# EAGLE design Gameboy_Cartridge (EAGLE 9.5.2)
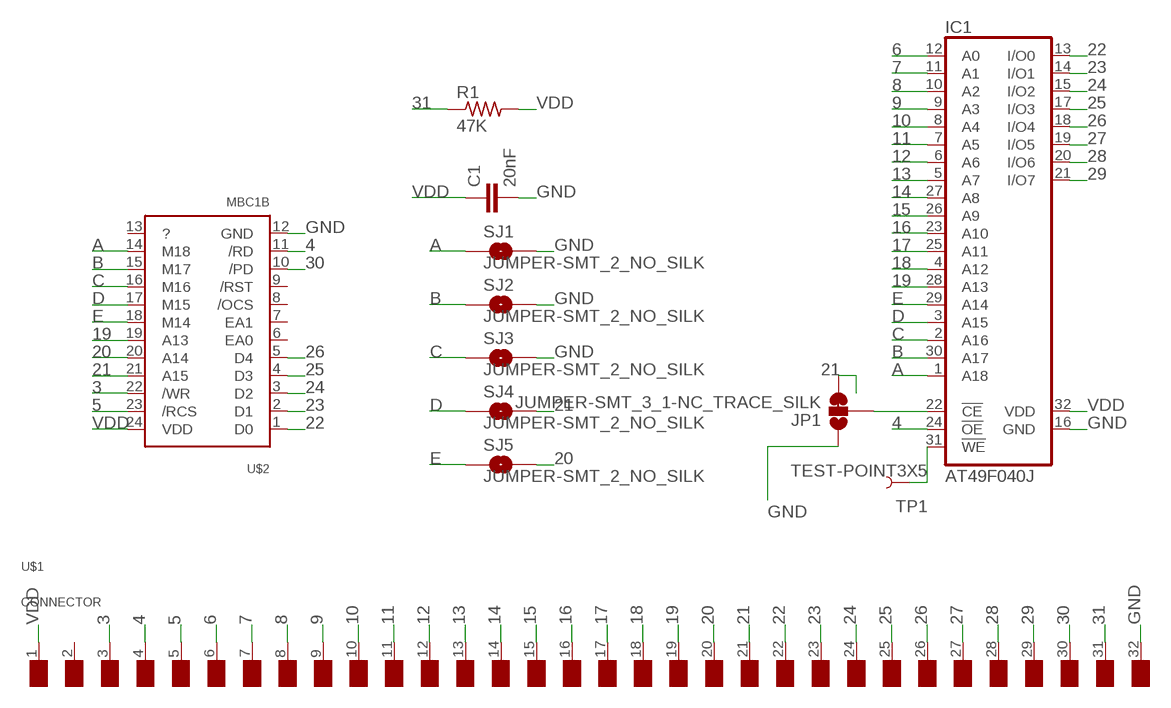
[diagram p0: schematic, sheet 1]

## Parts
C1  20nF  C-EUC0805  [C0805]
IC1  AT49F040J  [PLCC32R]
JP1  JUMPER-SMT_3_1-NC_TRACE_SILK  [SMT-JUMPER_3_1-NC_TRACE_SILK]
R1  47K  R-US_M0805  [M0805]
SJ1  JUMPER-SMT_2_NO_SILK  [SMT-JUMPER_2_NO_SILK]
SJ2  JUMPER-SMT_2_NO_SILK  [SMT-JUMPER_2_NO_SILK]
SJ3  JUMPER-SMT_2_NO_SILK  [SMT-JUMPER_2_NO_SILK]
SJ4  JUMPER-SMT_2_NO_SILK  [SMT-JUMPER_2_NO_SILK]
SJ5  JUMPER-SMT_2_NO_SILK  [SMT-JUMPER_2_NO_SILK]
TP1  TEST-POINT3X5  [PAD.03X.05]
U$1  CONNECTOR  [CONNECTOR]
U$2  MBC1B  [MBC1B]

## Nets
3: U$1.3(/WR) U$2.22(/WR)
4: IC1.24(!OE) U$1.4(/RD) U$2.11(/RD)
5: U$1.5(/RCS) U$2.23(/RCS)
6: IC1.12(A0) U$1.6(A0)
7: IC1.11(A1) U$1.7(A1)
8: IC1.10(A2) U$1.8(A2)
9: IC1.9(A3) U$1.9(A3)
10: IC1.8(A4) U$1.10(A4)
11: IC1.7(A5) U$1.11(A5)
12: IC1.6(A6) U$1.12(A6)
13: IC1.5(A7) U$1.13(A7)
14: IC1.27(A8) U$1.14(A8)
15: IC1.26(A9) U$1.15(A9)
16: IC1.23(A10) U$1.16(A10)
17: IC1.25(A11) U$1.17(A11)
18: IC1.4(A12) U$1.18(A12)
19: IC1.28(A13) U$1.19(A13) U$2.19(A13)
20: SJ5.2 U$1.20(A14) U$2.20(A14)
21: JP1.3 SJ4.2 U$1.21(A15) U$2.21(A15)
22: IC1.13(I/O0) U$1.22(D0) U$2.1(D0)
23: IC1.14(I/O1) U$1.23(D1) U$2.2(D1)
24: IC1.15(I/O2) U$1.24(D2) U$2.3(D2)
25: IC1.17(I/O3) U$1.25(D3) U$2.4(D3)
26: IC1.18(I/O4) U$1.26(D4) U$2.5(D4)
27: IC1.19(I/O5) U$1.27(D5)
28: IC1.20(I/O6) U$1.28(D6)
29: IC1.21(I/O7) U$1.29(D7)
30: U$1.30(/RS) U$2.10(/PD)
31: R1.1 U$1.31(VIN)
A: IC1.1(A18) SJ1.1 U$2.14(M18)
B: IC1.30(A17) SJ2.1 U$2.15(M17)
C: IC1.2(A16) SJ3.1 U$2.16(M16)
D: IC1.3(A15) SJ4.1 U$2.17(M15)
E: IC1.29(A14) SJ5.1 U$2.18(M14)
GND: C1.2 IC1.16(GND) JP1.1 SJ1.2 SJ2.2 SJ3.2 U$1.32(GND) U$2.12(GND)
N$1: IC1.31(!WE) TP1.P$1
N$2: IC1.22(!CE) JP1.2
VDD: C1.1 IC1.32(VDD) R1.2 U$1.1(VDD) U$2.24(VDD)
Unconnected: U$1.2(NC) U$2.6(EA0) U$2.7(EA1) U$2.8(/OCS) U$2.9(/RST) U$2.13(?)

## Library data of the parts
C1 = resistor:C-EU: CAPACITOR, European symbol
IC1 = gameboy:AT49F040J: 4-Megabit FLASH MEMORY (512 K x 8 bit) 5 V-only
JP1 = SparkFun-Jumpers:JUMPER-SMT_3_1-NC_TRACE: Normally closed trace jumper (1 of 2 connections) This jumper has a trace between two pads so it's normally closed (NC). The other connection is normally open (NO). Use a razor knife to open the connection. For best results follow the IPC guidelines for cutting traces: Cutout at least 0.063 mm (0.005 in). Remove all loose material to clean up the cut area. Seal the cut with an approved epoxy. Reapply solder to reclose the connection, or to close the NO connection.
R1 = resistor:R-US_: RESISTOR, American symbol
SJ1-SJ5 = SparkFun-Jumpers:JUMPER-SMT_2_NO: Normally open jumper This jumper has two pads in close proximity to each other. Apply solder to close the connection. Round pads are easier to solder for beginners, but are a lot larger. SparkFun Product that uses the round pads: SparkFun EL Sequencer <https://www.sparkfun.com/products/12781>
TP1 = SparkFun-Connectors:TEST-POINT: SparkFun Test Points Bare copper test points for troubleshooting or In-Circuit-Testing. These are used by our Production team for verifying production board runs using pogo-pins on test beds. SparkFun Products: SparkFun LSM9DS1 Breakout <https://www.sparkfun.com/products/13284> SparkFun PSOC <https://www.sparkfun.com/products/13714> SparkFun Load Cell Amplifier <https://www.sparkfun.com/products/13879>
U$1 = gameboy:CONNECTOR: Connector Pads for Gameboy Cartridges
U$2 = gameboy:MBC1B: Nintendo Gameboy cartridge Memory Bank Controller (MBC) Specifically based on the MBC1-B chip

## Board
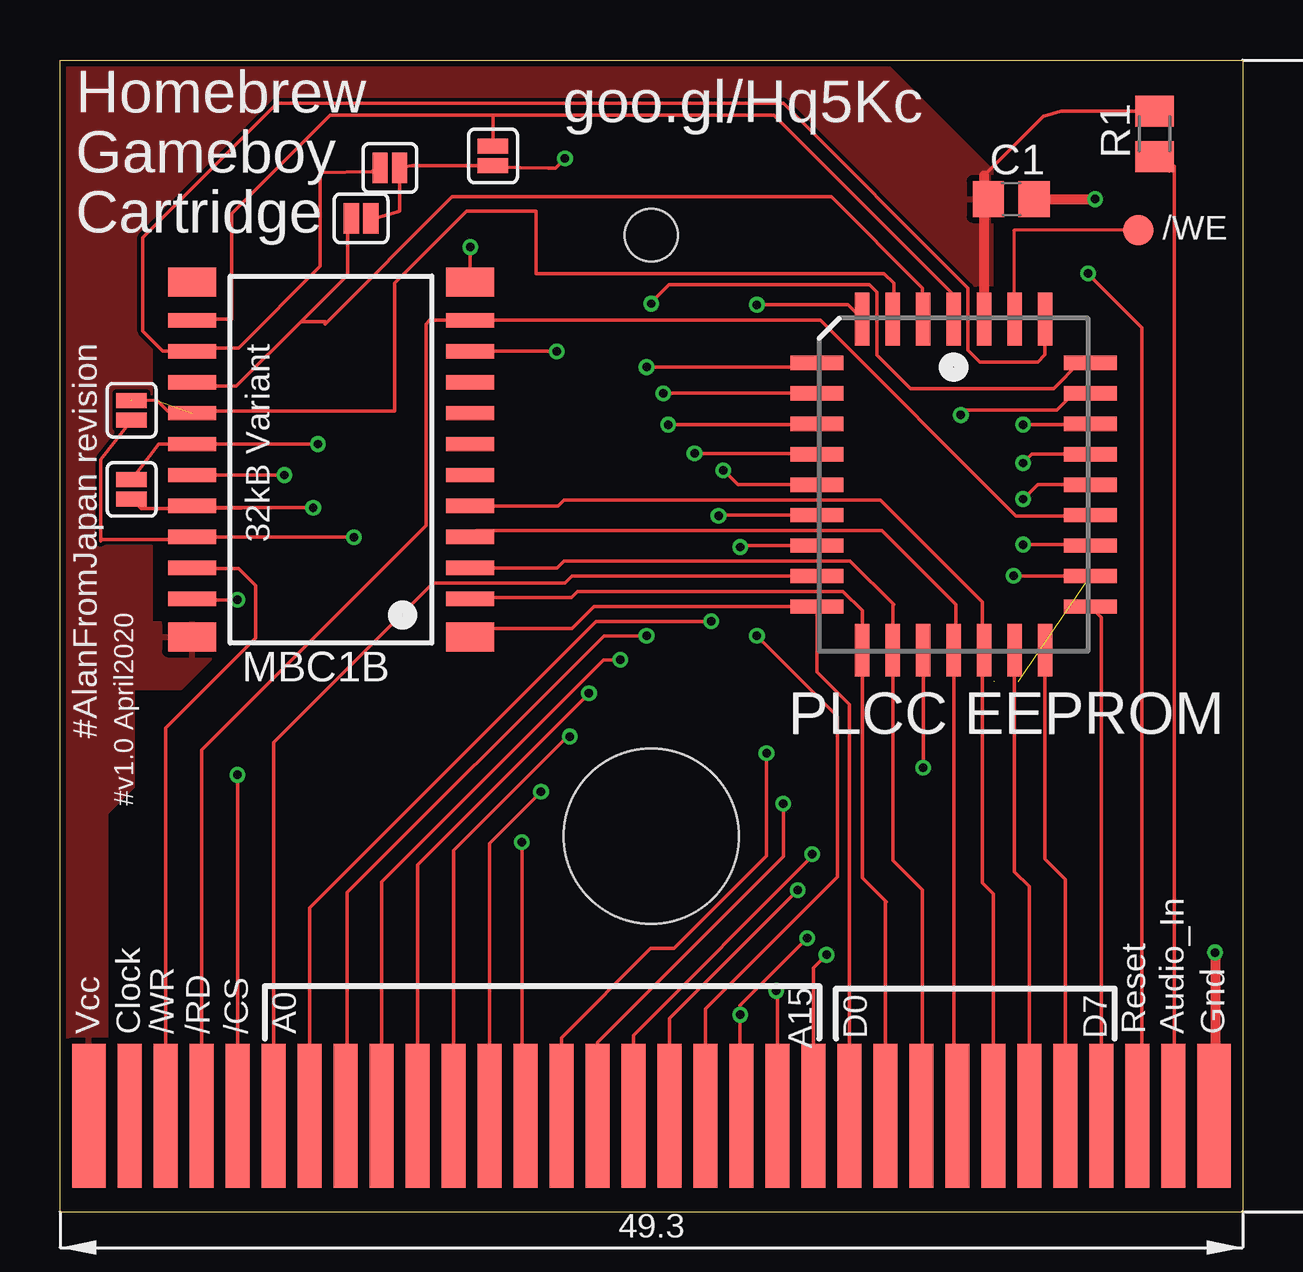
[diagram p1: board, top side]
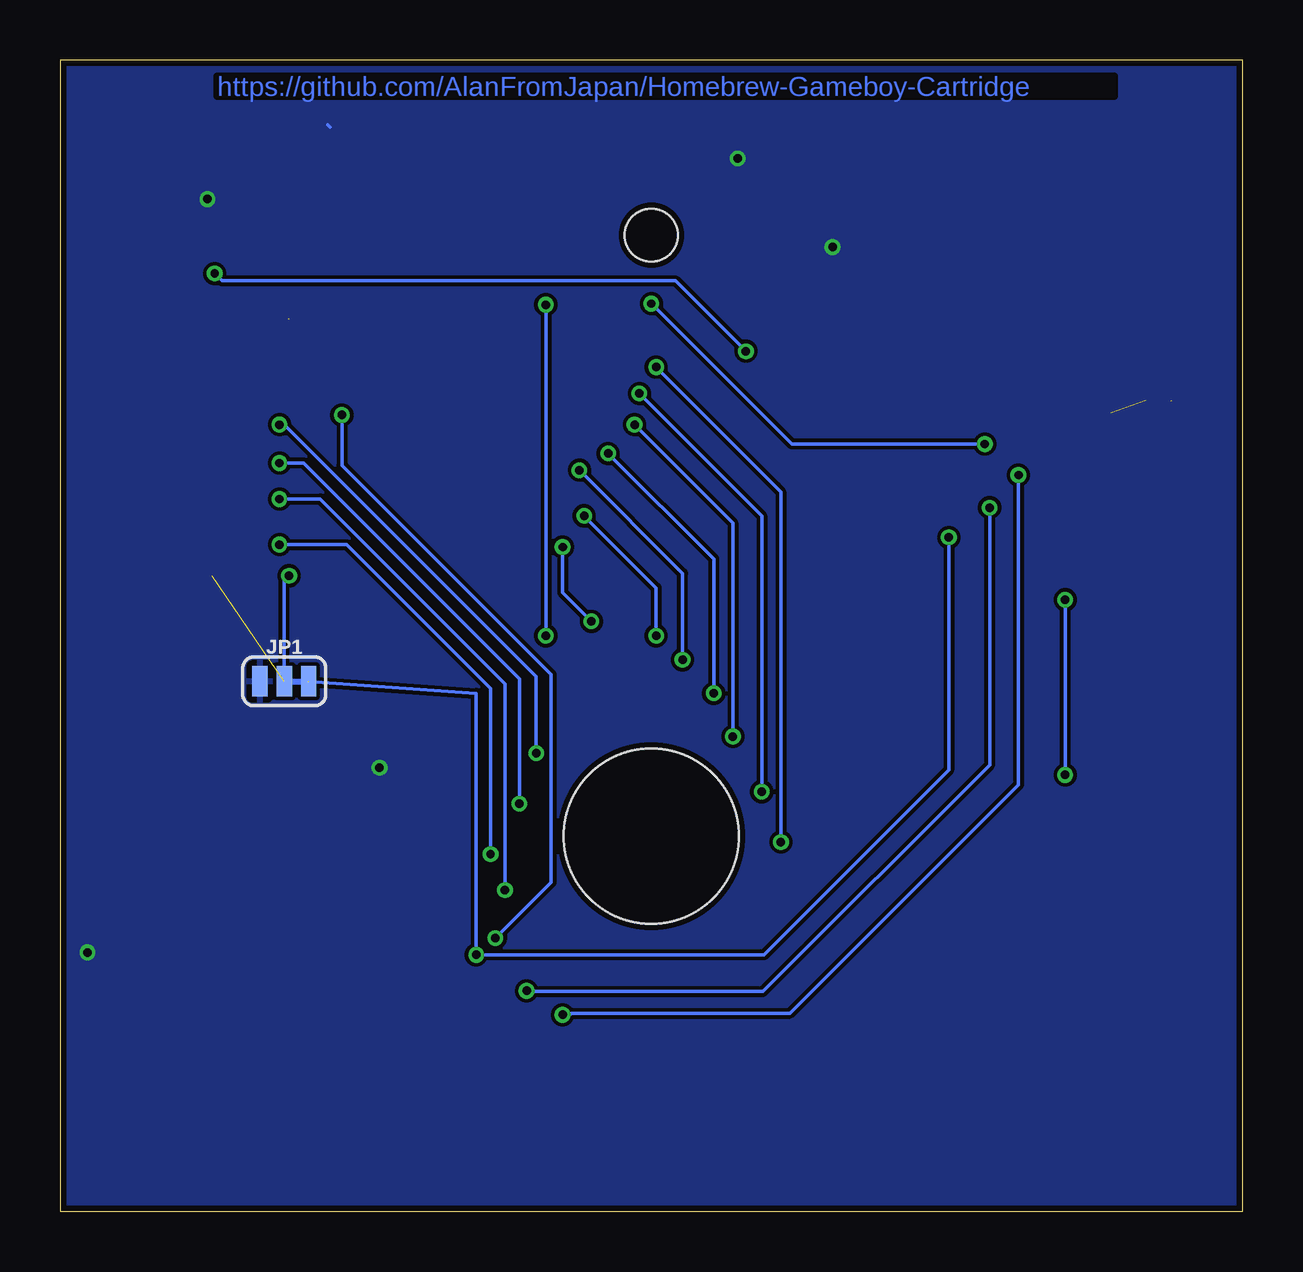
[diagram p2: board, bottom side, seen from below]

Size 49.3 x 48 mm. Coordinates in mm from the lower left corner, seen from the top.
Outline: 49.3,48 49.3,0 0,0 0,48 49.3,48
Copper layers (1*16): Top 0.035mm / dielectric 1.5mm / Bottom 0.035mm
Design rules "default": minimum track width 6mil, minimum drill 12mil, track to track 6mil, track to pad 6mil, pad to pad 6mil, via to via 6mil, smd to smd 0mil, copper to edge 10mil, drill to drill 10mil, minimum pad ring 10mil, minimum via ring 6mil, stop-mask expansion 2mil, vias tented up to drill 100mil, thermal gap 10mil
Holes 7.3 mm at 24.65,15.65
Holes 2.2 mm at 24.65,40.7

### Footprints (pad centres in the part's own frame; a part is rotated, then mirrored left to right if it is on the bottom)
C0805 = smd 1.3 x 1.5: 1 -0.95,0; 2 0.95,0
PLCC32R = smd 0.6 x 2.2: 1 0,6.9; 2 -1.27,6.9; 3 -2.54,6.9; 4 -3.81,6.9; 14 -3.81,-6.9; 15 -2.54,-6.9; 16 -1.27,-6.9; 17 0,-6.9; 18 1.27,-6.9; 19 2.54,-6.9; 20 3.81,-6.9; 30 3.81,6.9; 31 2.54,6.9; 32 1.27,6.9 | smd 2.2 x 0.6: 5 -5.7,5.08; 6 -5.7,3.81; 7 -5.7,2.54; 8 -5.7,1.27; 9 -5.7,0; 10 -5.7,-1.27; 11 -5.7,-2.54; 12 -5.7,-3.81; 13 -5.7,-5.08; 21 5.7,-5.08; 22 5.7,-3.81; 23 5.7,-2.54; 24 5.7,-1.27; 25 5.7,0; 26 5.7,1.27; 27 5.7,2.54; 28 5.7,3.81; 29 5.7,5.08
SMT-JUMPER_3_1-NC_TRACE_SILK = smd 0.635 x 1.27: 1 -1.016,0; 2 0,0; 3 1.016,0
M0805 = smd 1.3 x 1.6: 1 -0.95,0; 2 0.95,0
SMT-JUMPER_2_NO_SILK = smd 0.635 x 1.27: 1 -0.406,0; 2 0.406,0
PAD.03X.05 = smd 1.27 x 1.27: P$1 0,0
CONNECTOR = smd 1.4 x 6: 1 0.7,-3; 32 47.6,-3 | smd 1 x 6: 2 2.4,-3; 3 3.9,-3; 4 5.4,-3; 5 6.9,-3; 6 8.4,-3; 7 9.9,-3; 8 11.4,-3; 9 12.9,-3; 10 14.4,-3; 11 15.9,-3; 12 17.4,-3; 13 18.9,-3; 14 20.4,-3; 15 21.9,-3; 16 23.4,-3; 17 24.9,-3; 18 26.4,-3; 19 27.9,-3; 20 29.4,-3; 21 30.9,-3; 22 32.4,-3; 23 33.9,-3; 24 35.4,-3; 25 36.9,-3; 26 38.4,-3; 27 39.9,-3; 28 41.4,-3; 29 42.9,-3; 30 44.4,-3; 31 45.9,-3
MBC1B = smd 2 x 1.2: 1 1,-0.6; 12 1,-15.39; 13 12.6,-15.39; 24 12.6,-0.6 | smd 2 x 0.6: 2 1,-2.19; 3 1,-3.48; 4 1,-4.77; 5 1,-6.06; 6 1,-7.35; 7 1,-8.64; 8 1,-9.93; 9 1,-11.22; 10 1,-12.51; 11 1,-13.8; 14 12.6,-13.8; 15 12.6,-12.51; 16 12.6,-11.22; 17 12.6,-9.93; 18 12.6,-8.64; 19 12.6,-7.35; 20 12.6,-6.06; 21 12.6,-4.77; 22 12.6,-3.48; 23 12.6,-2.19

### Placement (x,y rotation side)
C1  39.65,42.2 0 top
IC1  37.25,30.3 0 top
JP1  39.95,22.1 0 bottom
R1  45.63,44.92 90 top
SJ1  18.05,44 270 top
SJ2  13.75,43.5 0 top
SJ3  12.55,41.4 0 top
SJ4  2.99,33.4 270 top
SJ5  2.99,30.1 270 top
TP1  44.95,40.9 0 top
U$1  0.5,7 0 top
U$2  18.1,23.35 180 top

### Tracks (layer width: path | path; a pad name or v marks a point on that pad's centre or on a via)
3
  Top 0.152: U$1.3 4.4,20.15 8.15,23.9 8.15,26.1 7.45,26.8 5.47,26.8 U$2.22
4
  Top 0.152: IC1.24 42.92,29 39.85,29 31.7,37.15 U$2.11 17.25,37.15 15.4,37.15 15.25,37 15.25,33.2 15.25,28.6 5.9,19.25 U$1.4
5  (via drill 0.35)
  Top 0.152: U$1.5 v7.4,18.2 | v7.4,25.5 5.54,25.5 U$2.23
  Bottom 0.152: v7.4,18.2 v7.4,25.5
6
  Top 0.152: IC1.12 21.35,26.5 21.05,26.2 15.55,26.2 8.9,19.55 U$1.6
7  (via drill 0.35)
  Top 0.152: U$1.7 10.4,12.65 22.35,24.6 v27.15,24.6 | v28.35,27.7 28.41,27.76 IC1.11
  Bottom 0.152: v28.35,27.7 28.35,25.8 v27.15,24.6
8  (via drill 0.35)
  Top 0.152: U$1.8 11.97,4.07 11.97,13.3 22.67,24 v24.45,24 | v27.45,29 27.48,29.03 IC1.10
  Bottom 0.152: v24.45,24 24.45,26 v27.45,29
9  (via drill 0.35)
  Top 0.152: v23.35,23 22.65,23 13.4,13.75 U$1.9 | IC1.9 28.25,30.3 v27.65,30.9
  Bottom 0.152: v23.35,23 23.35,26.6 v27.65,30.9
10  (via drill 0.35)
  Top 0.152: U$1.10 14.9,14.45 v22.05,21.6 | IC1.8 31.46,31.66 31.41,31.6 27.94,31.6 v26.45,31.6
  Bottom 0.152: v22.05,21.6 22.05,27.2 v26.45,31.6
11  (via drill 0.35)
  Top 0.152: U$1.11 16.4,15.05 21.15,19.8 v21.25,19.8 | v25.35,32.8 31.51,32.8 IC1.7
  Bottom 0.152: v21.25,19.8 21.25,28.7 v25.35,32.8
12  (via drill 0.35)
  Top 0.152: U$1.12 17.9,15.35 v20.05,17.5 | v25.15,34.1 v25.16,34.11 IC1.6
  Bottom 0.152: v25.15,34.1 20.05,29 v20.05,17.5
13  (via drill 0.35)
  Top 0.152: v24.45,35.2 31.37,35.2 IC1.5 | U$1.13 19.25,4.15 v19.25,15.4
  Bottom 0.152: v24.45,35.2 19.45,30.2 19.25,30 v19.25,15.4
14  (via drill 0.35)
  Top 0.152: U$1.14 20.9,7.25 24.62,10.97 25.6,10.97 29.45,14.82 v29.45,19.1 | v40.15,32.8 42.91,32.8 IC1.27
  Bottom 0.152: v29.45,19.1 29.45,19.3 29.45,22.3 39.95,32.8 v40.15,32.8
15  (via drill 0.35)
  Top 0.152: U$1.15 22.4,7.05 30.15,14.8 v30.15,17 | v40.15,31.2 40.52,31.57 IC1.26
  Bottom 0.152: v30.15,17 30.15,17.1 30.15,22.2 39.15,31.2 v40.15,31.2
16  (via drill 0.35)
  Top 0.152: U$1.16 23.9,7.35 31.35,14.8 v31.35,14.9 | v40.15,27.8 42.91,27.8 IC1.23
  Bottom 0.152: v31.35,14.9 31.35,21.8 37.35,27.8 v40.15,27.8
17  (via drill 0.35)
  Top 0.152: U$1.17 25.4,8.05 v30.75,13.4 | v40.15,29.7 40.75,30.3 IC1.25
  Bottom 0.152: v30.75,13.4 30.75,13.6 30.75,22 38.45,29.7 v40.15,29.7
18  (via drill 0.35)
  Top 0.152: U$1.18 26.9,8.45 32.41,13.96 32.41,20.64 v29.05,24 | IC1.4 32.84,37.8 v29.05,37.8
  Bottom 0.152: v29.05,37.8 v29.05,24
19  (via drill 0.35)
  Top 0.152: U$1.19 28.35,4.05 v28.35,8.2 28.35,8.6 v31.15,11.4 | v9.35,30.7 U$2.19 | IC1.28 42.26,34.11 41.55,33.4 37.75,33.4 v37.55,33.2
  Bottom 0.152: v28.35,8.2 28.05,8.2 27.98,8.27 18.88,8.27 9.35,17.79 v9.35,30.7 | v37.55,33.2 37.55,31.1 28.83,22.38 28.83,13.72 v31.15,11.4
20  (via drill 0.35)
  Top 0.152: SJ5.2 3.38,29.3 4.65,29.3 v10.55,29.34 5.57,29.34 U$2.20 | U$1.20 29.9,9.15 v29.85,9.2
  Bottom 0.152: v29.85,9.2 29.82,9.17 20,9.17 10.55,18.62 v10.55,29.34
21  (via drill 0.35)  (1 unrouted)
  Top 0.152: SJ4.2 1.69,31.34 1.69,27.94 1.77,28.02 5.4,28.02 U$2.21 12.27,28.12 12.27,28.1 v12.25,28.1 | U$1.21 31.4,10.15 v31.95,10.7
  Bottom 0.152: 38.95,22.1 31.95,21.6 v31.95,10.7 19.95,10.7 12.25,18.4 v12.25,28.1
22
  Top 0.152: U$1.22 32.9,21.14 31.55,22.49 IC1.13 22.27,25.22 21.35,24.3 17.45,24.3 U$2.1
23
  Top 0.152: U$1.23 34.4,12.95 34.45,12.9 33.44,13.91 33.44,23 | 33.44,23 IC1.14 | U$2.2 17.16,25.6 21.32,25.6 21.57,25.85 32.64,25.85 33.44,25.05 33.44,23
24
  Top 0.152: U$1.24 35.95,4.05 35.95,13.4 34.71,14.64 34.71,18.93 IC1.15 34.71,25.26 34.75,25.3 32.93,27.12 21.01,27.12 20.72,26.83 U$2.3
25
  Top 0.152: IC1.17 37.25,23.3 | 37.25,23.3 37.25,4.15 U$1.25 | U$2.4 17.37,28.39 34.26,28.39 37.35,25.3 37.35,23.4 37.25,23.3
26
  Top 0.152: U$1.26 38.9,13.25 38.45,13.7 38.45,23.33 | 38.45,23.33 IC1.18 | U$2.5 20.76,29.41 21.01,29.66 34.19,29.66 38.45,25.4 38.45,23.33
27
  Top 0.152: IC1.19 39.79,14.16 40.4,13.55 U$1.27
28
  Top 0.152: IC1.20 41.06,14.69 41.9,13.85 U$1.28
29
  Top 0.152: U$1.29 43.4,24.77 IC1.21
30  (via drill 0.35)
  Top 0.152: U$2.10 v20.71,35.86 | U$1.30 45.1,4.2 45.1,36.85 v42.85,39.1
  Bottom 0.152: v20.71,35.86 23.65,38.8 42.55,38.8 v42.85,39.1
31
  Top 0.152: U$1.31 46.45,4.05 46.45,43.58 46.23,43.37 R1.1
A
  Top 0.152: SJ1.1 18.05,45.69 18.04,45.7 | U$2.14 5.55,37.2 7.15,37.2 7.15,41.6 11.25,45.7 18.04,45.7 | IC1.1 37.25,38.2 29.75,45.7 18.05,45.7 18.04,45.7
B
  Top 0.152: SJ2.1 12.99,43.35 10.85,43.3 10.85,39.4 7.45,36 5.64,36 U$2.15 4.29,35.86 3.45,36.7 3.45,40.6 9.05,46.2 30.15,46.2 37.85,38.5 37.85,35.9 38.35,35.4 40.75,35.4 41.06,35.71 IC1.30
C
  Top 0.152: SJ3.1 11.99,41.32 11.99,39.04 10.05,37.1 | 10.05,37.1 7.35,34.4 5.67,34.4 U$2.16 | IC1.2 35.95,37.23 35.95,38.5 32.15,42.3 16.35,42.3 11.05,37 11.05,37.1 10.05,37.1
D  (2 unrouted)
  Top 0.127: 4.05,33.8 2.95,33.8
  Top 0.152: 34.75,37.16 34.75,38.7 34.35,39.1 19.85,39.1 19.85,41.7 16.95,41.7 13.95,38.7 13.95,33.36 4.49,33.36 4.05,33.8 4.04,33.81 | 34.75,36.7 34.75,37.16 | 34.75,37.16 IC1.3
E  (via drill 0.35)
  Top 0.152: U$2.18 v10.75,31.99 4.12,31.99 SJ5.1 | IC1.29 42.5,35.38 41.42,34.3 35.45,34.3 34.05,35.7 34.05,38.31 33.73,38.63 25.38,38.63 24.65,37.9 v24.65,37.84
  Bottom 0.152: v10.75,31.99 18.8,31.99 v24.65,37.84
GND  (via drill 0.35)
  Top 0.152: SJ3.2 13.15,41.4 14.02,41.66 14.16,41.7 SJ2.2 14.17,43.54 14.69,43.59 SJ1.2 18.05,43.53 20.35,43.5 20.65,43.5 v21.05,43.9 | 40.8,42.2 40.75,42.16 C1.2 | IC1.16 v35.98,18.5 | U$1.32 48.15,4.05 | 17.06,38.7 U$2.12 v17.1,40.2
  Top 0.406: 40.8,42.2 v43.15,42.2 | v48.15,10.8 48.15,4.05
  Bottom 0.152: 38.15,45.3 38.05,45.2 | v17.1,40.2 17.25,40.2
  pour Bottom: 0.15,47.9 49.15,47.9 49.15,0.1 0.15,0.1
N$1  (1 unrouted)
  Top 0.127: TP1.P$1 39.75,40.9 39.75,37.2
N$2  (1 unrouted)
N$3  (via drill 0.35)
  Top 0.152: v39.75,26.5 42.95,26.5
  Bottom 0.152: 39.95,22.2 39.95,26.5 v39.75,26.5
VDD
  Top 0.152: R1.2 41.72,45.87 41.02,45.65 40.99,45.65 38.52,43.18
  Top 0.406: 38.52,43.18 IC1.32
  pour Top: 1.95,6.7 1.95,16.6 3.05,17.7 3.05,21.8 5.05,21.8 6.45,23.2 6.45,24.54 3.81,24.54 3.81,39.16 7.35,42.7 33.65,42.7 38.25,38.1 38.25,38 38.35,37.9 38.85,37.9 38.85,43.4 34.35,47.9 0.15,47.9 0.15,7.4 0.85,6.7

### Text on the board
Bottom: https://github.com/AlanFromJapan/Homebrew-Gameboy-Cartridge
tPlace: Homebrew | goo.gl/Hq5Kc | Gameboy | Cartridge | /WE | 32kB Variant | #AlanFromJapan revision | #v1.0 April2020 | Vcc | Clock | /WR | /RD | /CS | A0 | A15 | D0 | D7 | Reset | Audio_In | Gnd
tNames: PLCC EEPROM